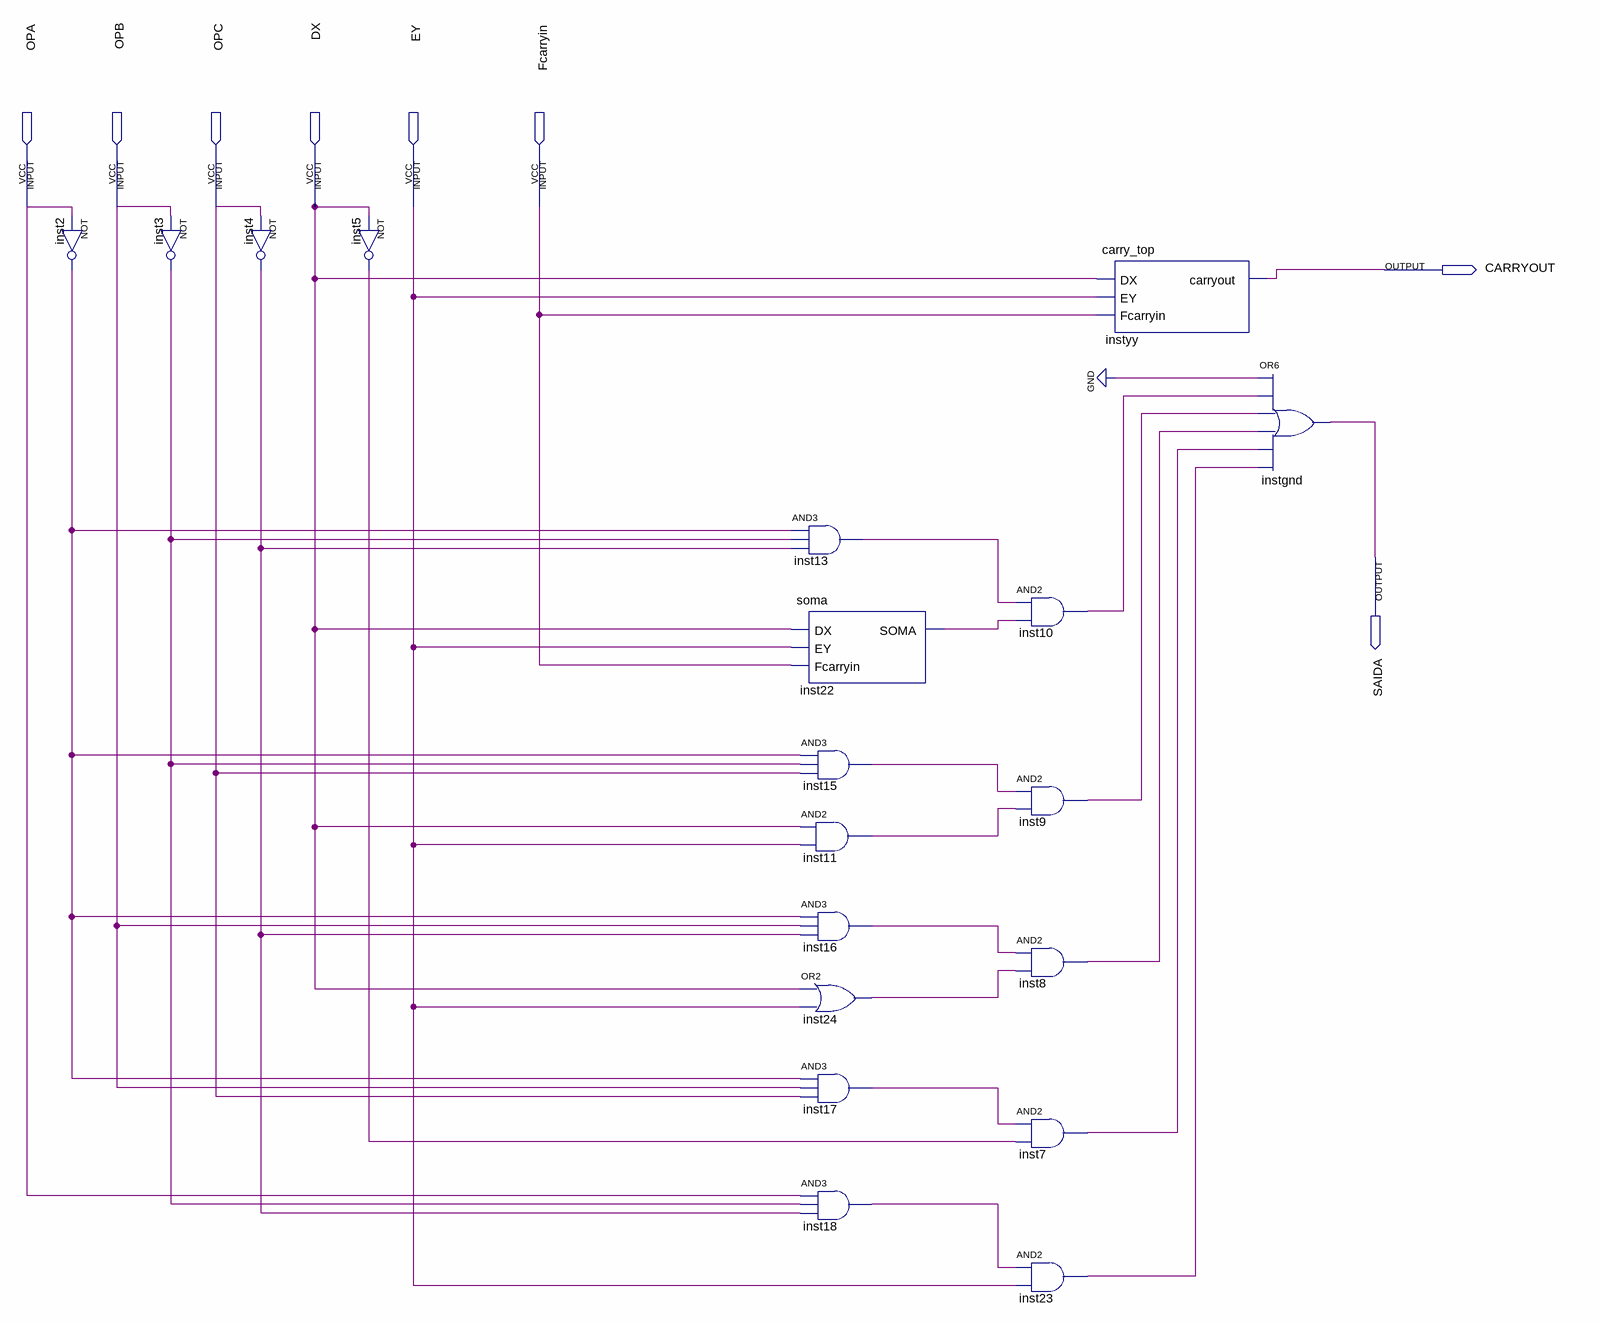
[diagram p0: schematic sheet]
// Quartus schematic ula_top.bdf as structural Verilog: 19 symbols, 8 pins
module ula_top (
  input  OPA,
  input  OPB,
  input  OPC,
  input  DX,
  input  EY,
  input  Fcarryin,
  output CARRYOUT,
  output SAIDA
);

  wire inst2_out, inst3_out, inst4_out, inst5_out, inst7_out, inst8_out, inst9_out, inst10_out, inst11_out,
       inst13_out, inst15_out, inst16_out, inst17_out, inst18_out, inst22_soma, inst23_out, inst24_out;

  not inst2 (inst2_out, OPA);
  not inst3 (inst3_out, OPB);
  not inst4 (inst4_out, OPC);
  not inst5 (inst5_out, DX);
  and inst13 (inst13_out, inst2_out, inst3_out, inst4_out);
  soma inst22 (.DX(DX), .EY(EY), .Fcarryin(Fcarryin), .SOMA(inst22_soma));
  and inst15 (inst15_out, inst2_out, inst3_out, OPC);
  and inst11 (inst11_out, DX, EY);
  and inst16 (inst16_out, inst2_out, OPB, inst4_out);
  or inst24 (inst24_out, DX, EY);
  and inst17 (inst17_out, inst2_out, OPB, OPC);
  and inst18 (inst18_out, OPA, inst3_out, inst4_out);
  and inst10 (inst10_out, inst13_out, inst22_soma);
  and inst9 (inst9_out, inst15_out, inst11_out);
  and inst8 (inst8_out, inst16_out, inst24_out);
  and inst7 (inst7_out, inst17_out, inst5_out);
  and inst23 (inst23_out, inst18_out, EY);
  carry_top instyy (.DX(DX), .EY(EY), .Fcarryin(Fcarryin), .carryout(CARRYOUT));
  or instgnd (SAIDA, 1'b0, inst10_out, inst9_out, inst8_out, inst7_out, inst23_out);
endmodule
